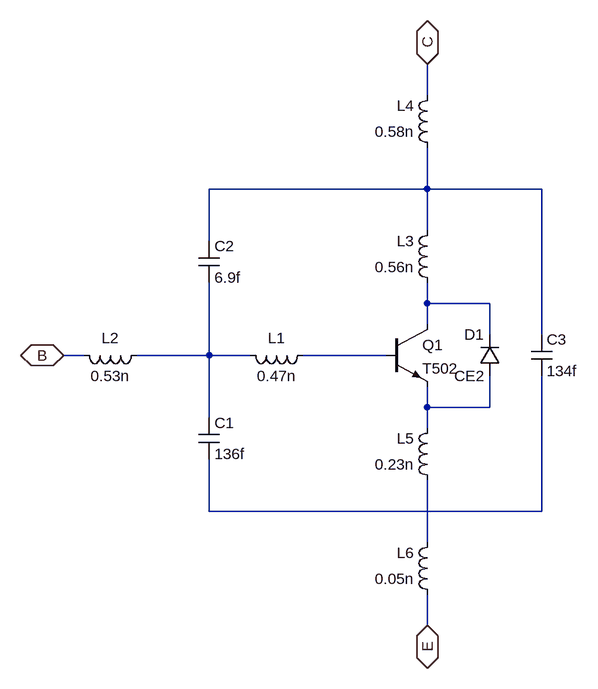
[diagram p0: schematic TransistorReal.asc]
TransistorReal.asc, the LTspice schematic file:
Version 4
SHEET 1 880 872
WIRE 448 -16 448 -64
WIRE 448 128 448 64
WIRE 448 128 112 128
WIRE 624 128 448 128
WIRE 448 192 448 128
WIRE 112 208 112 128
WIRE 448 304 448 272
WIRE 544 304 448 304
WIRE 448 336 448 304
WIRE 544 352 544 304
WIRE 624 352 624 128
WIRE -80 384 -112 384
WIRE 112 384 112 272
WIRE 112 384 0 384
WIRE 176 384 112 384
WIRE 384 384 256 384
WIRE 448 464 448 432
WIRE 544 464 544 416
WIRE 544 464 448 464
WIRE 112 480 112 384
WIRE 448 496 448 464
WIRE 112 624 112 544
WIRE 624 624 624 416
WIRE 624 624 112 624
WIRE 448 672 448 576
WIRE 448 800 448 752
FLAG -112 384 B
IOPIN -112 384 BiDir
FLAG 448 -64 C
IOPIN 448 -64 BiDir
FLAG 448 800 E
IOPIN 448 800 BiDir
SYMBOL npn 384 336 R0
SYMATTR InstName Q1
SYMATTR Value T502
SYMBOL ind 272 368 R90
WINDOW 0 5 56 VBottom 2
WINDOW 3 32 56 VTop 2
SYMATTR InstName L1
SYMATTR Value 0.47n
SYMBOL ind 16 368 R90
WINDOW 0 5 56 VBottom 2
WINDOW 3 32 56 VTop 2
SYMATTR InstName L2
SYMATTR Value 0.53n
SYMBOL ind 464 288 R180
WINDOW 0 36 80 Left 2
WINDOW 3 36 40 Left 2
SYMATTR InstName L3
SYMATTR Value 0.56n
SYMBOL ind 464 80 R180
WINDOW 0 36 80 Left 2
WINDOW 3 36 40 Left 2
SYMATTR InstName L4
SYMATTR Value 0.58n
SYMBOL ind 464 592 R180
WINDOW 0 36 80 Left 2
WINDOW 3 36 40 Left 2
SYMATTR InstName L5
SYMATTR Value 0.23n
SYMBOL ind 464 768 R180
WINDOW 0 36 80 Left 2
WINDOW 3 36 40 Left 2
SYMATTR InstName L6
SYMATTR Value 0.05n
SYMBOL Cap 96 480 R0
SYMATTR InstName C1
SYMATTR Value 136f
SYMBOL Cap 96 208 R0
SYMATTR InstName C2
SYMATTR Value 6.9f
SYMBOL Cap 608 352 R0
SYMATTR InstName C3
SYMATTR Value 134f
SYMBOL Diode 560 416 R180
WINDOW 0 24 64 Left 2
WINDOW 3 24 0 Left 2
SYMATTR InstName D1
SYMATTR Value CE2

The netlist it stands for:
* TransistorReal.asc
Q1 N002 N004 N005 0 T502
L1 N004 N003 0.47n
L2 N003 B 0.53n
L3 N002 N001 0.56n
L4 N001 C 0.58n
L5 N007 N005 0.23n
L6 E N007 0.05n
C1 N003 N006 136f
C2 N001 N003 6.9f
C3 N001 N006 134f
D1 N005 N002 CE2
.model D D
.lib standard.dio
.model NPN NPN
.model PNP PNP
.lib standard.bjt
.backanno
.end